# EAGLE design switch-fuses (EAGLE 6.4)
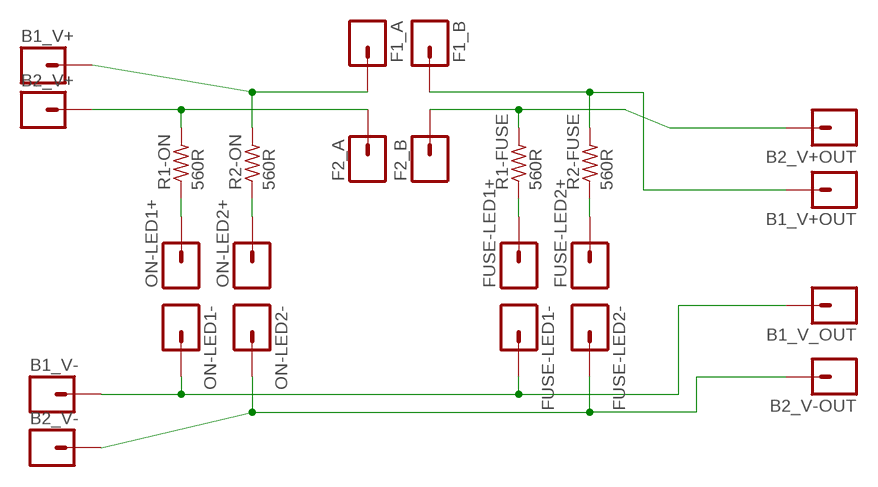
[diagram p0: schematic, sheet 1]

## Parts
B1_V+  1-HOLE2.5MM  [1-HOLE-2.5MM]
B1_V+OUT  1-HOLE2.5MM  [1-HOLE-2.5MM]
B1_V-  1-HOLE2.5MM  [1-HOLE-2.5MM]
B1_V_OUT  1-HOLE2.5MM  [1-HOLE-2.5MM]
B2_V+  1-HOLE2.5MM  [1-HOLE-2.5MM]
B2_V+OUT  1-HOLE2.5MM  [1-HOLE-2.5MM]
B2_V-  1-HOLE2.5MM  [1-HOLE-2.5MM]
B2_V-OUT  1-HOLE2.5MM  [1-HOLE-2.5MM]
F1_A  1-HOLE2.5MM  [1-HOLE-2.5MM]
F1_B  1-HOLE2.5MM  [1-HOLE-2.5MM]
F2_A  1-HOLE2.5MM  [1-HOLE-2.5MM]
F2_B  1-HOLE2.5MM  [1-HOLE-2.5MM]
FUSE-LED1+  1-HOLE0.8MM  [1-HOLE]
FUSE-LED1-  1-HOLE0.8MM  [1-HOLE]
FUSE-LED2+  1-HOLE0.8MM  [1-HOLE]
FUSE-LED2-  1-HOLE0.8MM  [1-HOLE]
ON-LED1+  1-HOLE0.8MM  [1-HOLE]
ON-LED1-  1-HOLE0.8MM  [1-HOLE]
ON-LED2+  1-HOLE0.8MM  [1-HOLE]
ON-LED2-  1-HOLE0.8MM  [1-HOLE]
R1-FUSE  560R  RESISTOR0309/15  [0309/15]
R1-ON  560R  RESISTOR0309/15  [0309/15]
R2-FUSE  560R  RESISTOR0309/15  [0309/15]
R2-ON  560R  RESISTOR0309/15  [0309/15]

## Nets
N$3: FUSE-LED1+.1 R1-FUSE.1
N$4: FUSE-LED2+.1 R2-FUSE.1
N$9: ON-LED1+.1 R1-ON.1
N$10: ON-LED2+.1 R2-ON.1
V+1: B2_V+OUT.P$1 F2_B.P$1 R1-FUSE.2
V+2 [Voltage]: B1_V+OUT.P$1 F1_B.P$1 R2-FUSE.2
V-1: B1_V-.P$1 B1_V_OUT.P$1 FUSE-LED1-.1 ON-LED1-.1
V-2: B2_V-.P$1 B2_V-OUT.P$1 FUSE-LED2-.1 ON-LED2-.1
VIN1 [Voltage]: B1_V+.P$1 F1_A.P$1 R2-ON.2
VIN2 [Voltage]: B2_V+.P$1 F2_A.P$1 R1-ON.2

## Library data of the parts
B1_V+ B1_V+OUT B1_V- B1_V_OUT B2_V+ B2_V+OUT B2_V- B2_V-OUT F1_A F1_B F2_A F2_B FUSE-LED1+ FUSE-LED1- FUSE-LED2+ FUSE-LED2- ON-LED1+ ON-LED1- ON-LED2+ ON-LED2- = parts:1-HOLE: ONE HOLE Single hole on board
R1-FUSE R1-ON R2-FUSE R2-ON = parts:RESISTOR: RESISTOR

## Net classes
0 default: width 3.048 mm, clearance 1.016 mm
1 Voltage: width 3.048 mm, clearance 1.016 mm

## Board
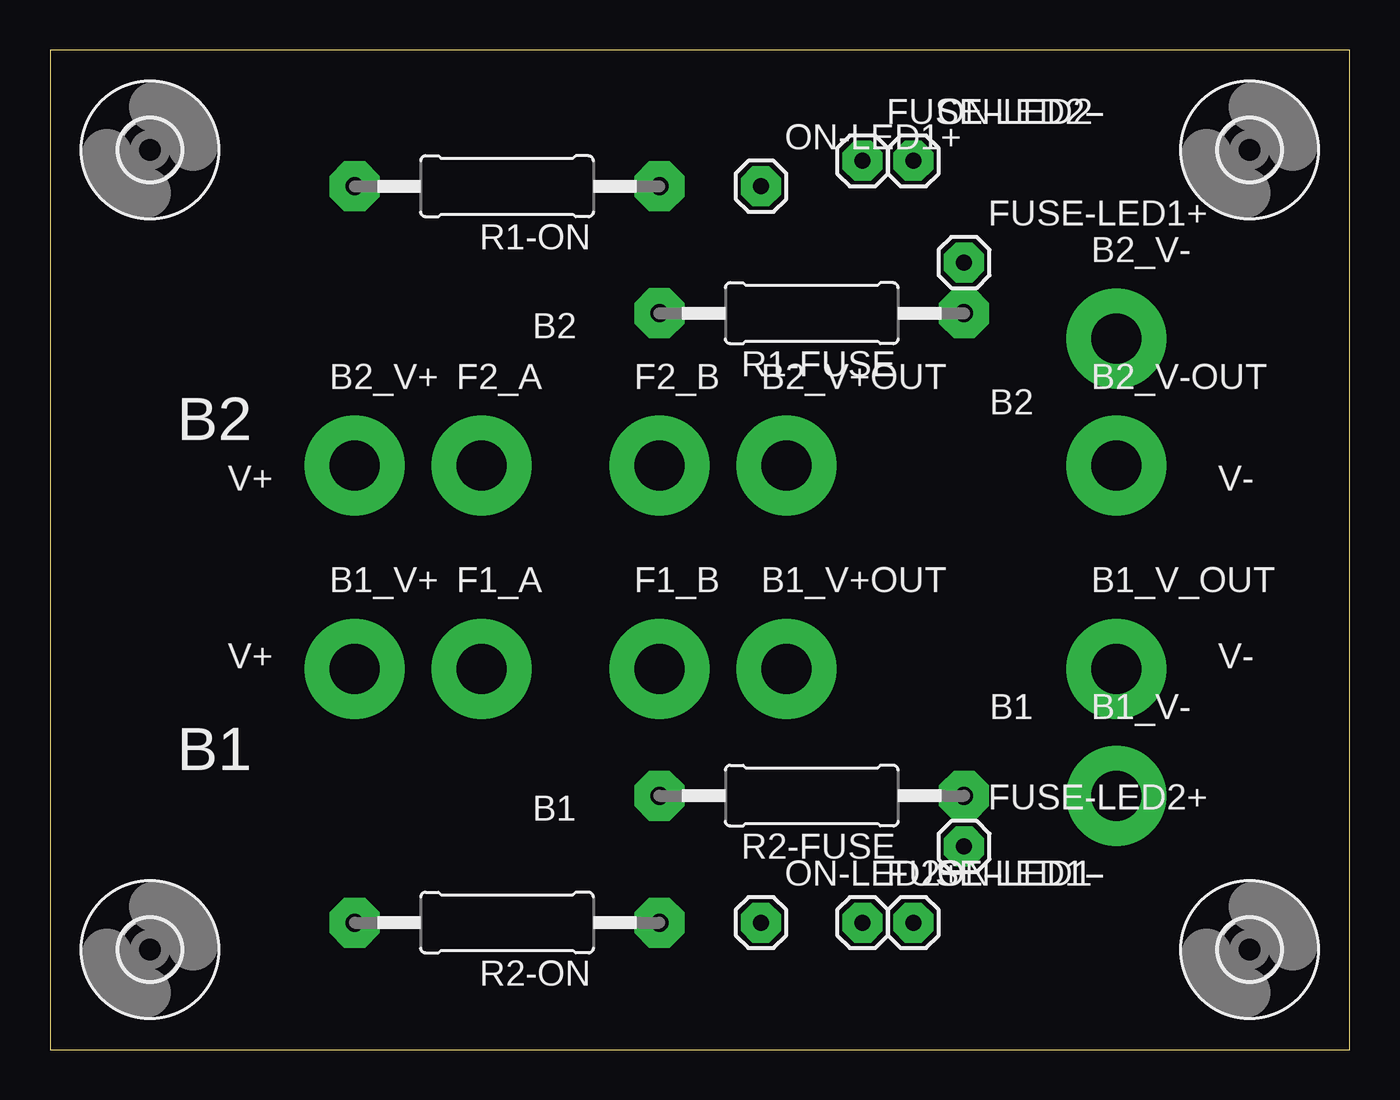
[diagram p1: board, top side]
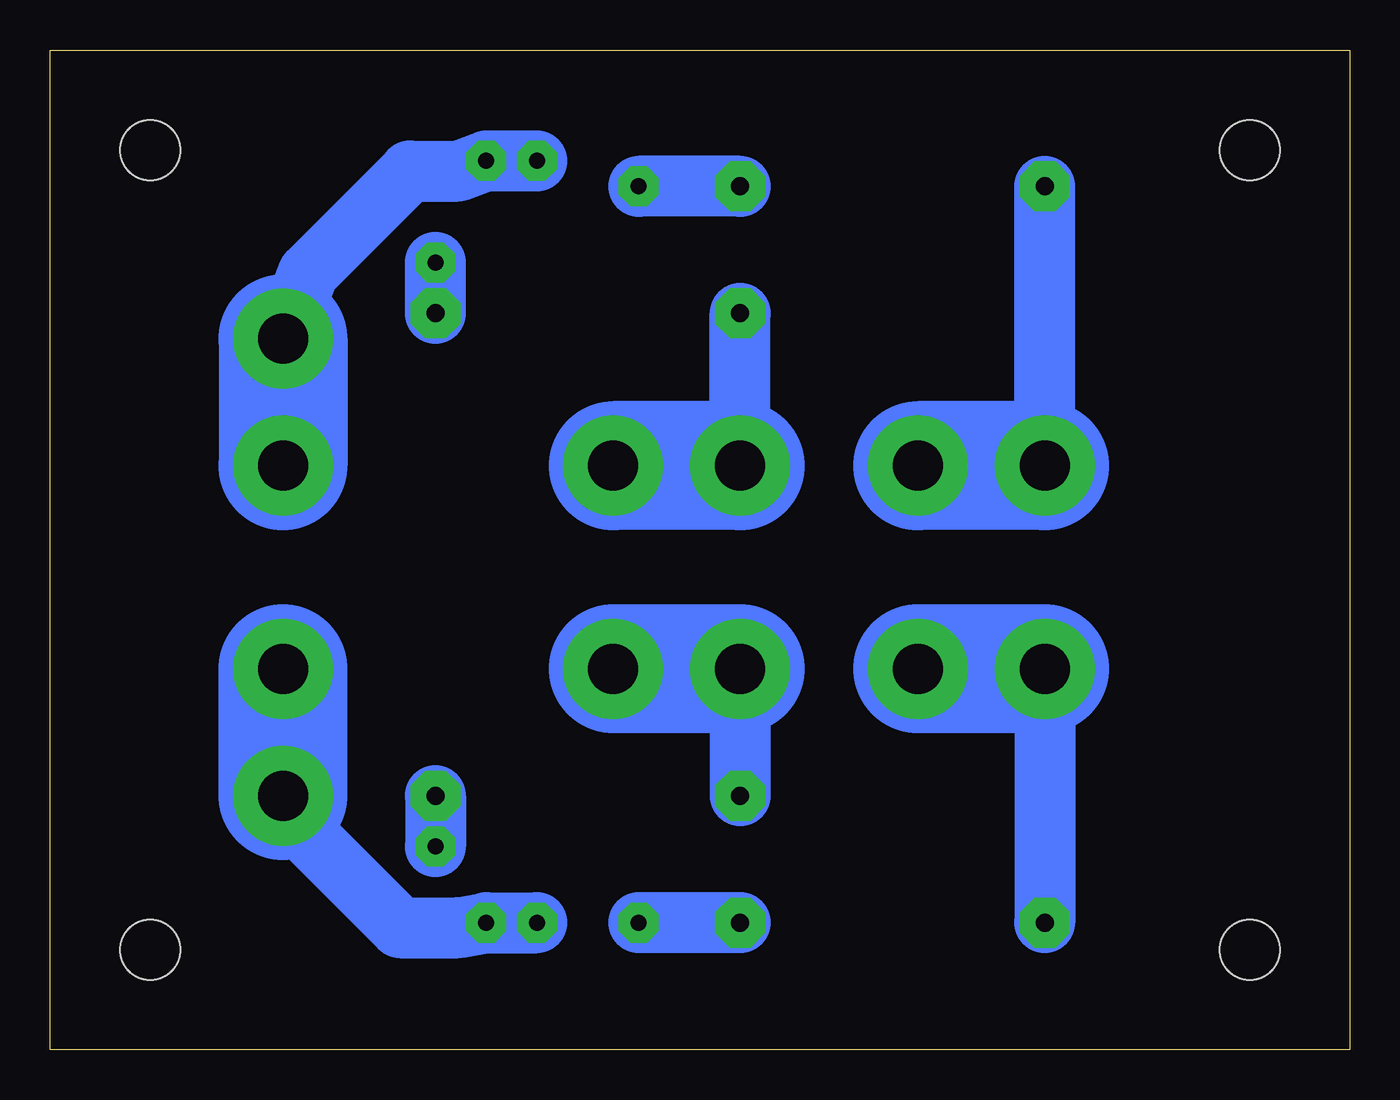
[diagram p2: board, bottom side, seen from below]

Size 65 x 50 mm. Coordinates in mm from the lower left corner, seen from the top.
Outline: 0,0 65,0 65,50 0,50 0,0
Copper layers (1*16): Top 0.035mm / dielectric 1.5mm / Bottom 0.035mm
Design rules "default *": minimum track width 10mil, minimum drill 24mil, track to track 30mil, track to pad 30mil, pad to pad 8mil, via to via 8mil, smd to smd 8mil, copper to edge 40mil, drill to drill 8mil, minimum pad ring 10mil, minimum via ring 8mil, stop-mask expansion 4mil, vias tented up to drill 0mil, thermal gap 0mil

### Footprints (pad centres in the part's own frame; a part is rotated, then mirrored left to right if it is on the bottom)
1-HOLE-2.5MM = drill 2.5 pad 5: P$1 0,0
1-HOLE = drill 0.8 pad 2 octagon: 1 0,0
0309/15 = drill 0.9 pad 2.5 octagon: 1 -7.62,0; 2 7.62,0
3,0 = hole 3: 0,0

### Placement (x,y rotation side)
B1_V+  15.24,19.05 0 top
B1_V+OUT  36.83,19.05 0 top
B1_V-  53.34,12.7 0 top
B1_V_OUT  53.34,19.05 0 top
B2_V+  15.24,29.21 0 top
B2_V+OUT  36.83,29.21 0 top
B2_V-  53.34,35.56 0 top
B2_V-OUT  53.34,29.21 0 top
F1_A  21.59,19.05 0 top
F1_B  30.48,19.05 0 top
F2_A  21.59,29.21 0 top
F2_B  30.48,29.21 0 top
FUSE-LED1+  45.72,39.37 0 top
FUSE-LED1-  40.64,6.35 0 top
FUSE-LED2+  45.72,10.16 0 top
FUSE-LED2-  40.64,44.45 0 top
ON-LED1+  35.56,43.18 0 top
ON-LED1-  43.18,6.35 0 top
ON-LED2+  35.56,6.35 0 top
ON-LED2-  43.18,44.45 0 top
R1-FUSE  38.1,36.83 180 top
R1-ON  22.86,43.18 180 top
R2-FUSE  38.1,12.7 180 top
R2-ON  22.86,6.35 180 top
U$1  [3,0]  5,45 0 top
U$2  [3,0]  60,45 0 top
U$3  [3,0]  5,5 0 top
U$4  [3,0]  60,5 0 top

### Tracks (layer width: path | path; a pad name or v marks a point on that pad's centre or on a via)
N$3
  Bottom 3.048: R1-FUSE.1 FUSE-LED1+.1
N$4
  Bottom 3.048: R2-FUSE.1 FUSE-LED2+.1
N$9
  Bottom 3.048: R1-ON.1 ON-LED1+.1
N$10
  Bottom 3.048: R2-ON.1 ON-LED2+.1
V+1
  Bottom 3.048: F2_B.P$1 R1-FUSE.2
  Bottom 6.452: F2_B.P$1 B2_V+OUT.P$1
V+2
  Bottom 3.048: F1_B.P$1 R2-FUSE.2
  Bottom 6.452: F1_B.P$1 B1_V+OUT.P$1
V-1
  Bottom 3.048: FUSE-LED1-.1 ON-LED1-.1 44.58,6.1 47.5,6.1 53.34,11.94 B1_V-.P$1
  Bottom 6.452: B1_V-.P$1 B1_V_OUT.P$1
V-2
  Bottom 3.048: FUSE-LED2-.1 ON-LED2-.1 44.58,43.94 46.99,43.94 52.07,38.86 B2_V-.P$1
  Bottom 6.452: B2_V-.P$1 B2_V-OUT.P$1
VIN1
  Bottom 3.048: B1_V+.P$1 R2-ON.2
  Bottom 6.452: B1_V+.P$1 F1_A.P$1
VIN2
  Bottom 3.048: B2_V+.P$1 R1-ON.2
  Bottom 6.452: B2_V+.P$1 F2_A.P$1

### Text on the board
_tsilk: B2 | B2 | B2 | V+ | V- | V+ | V- | B1 | B1 | B1